# Altium project Project_Left.PrjPcb
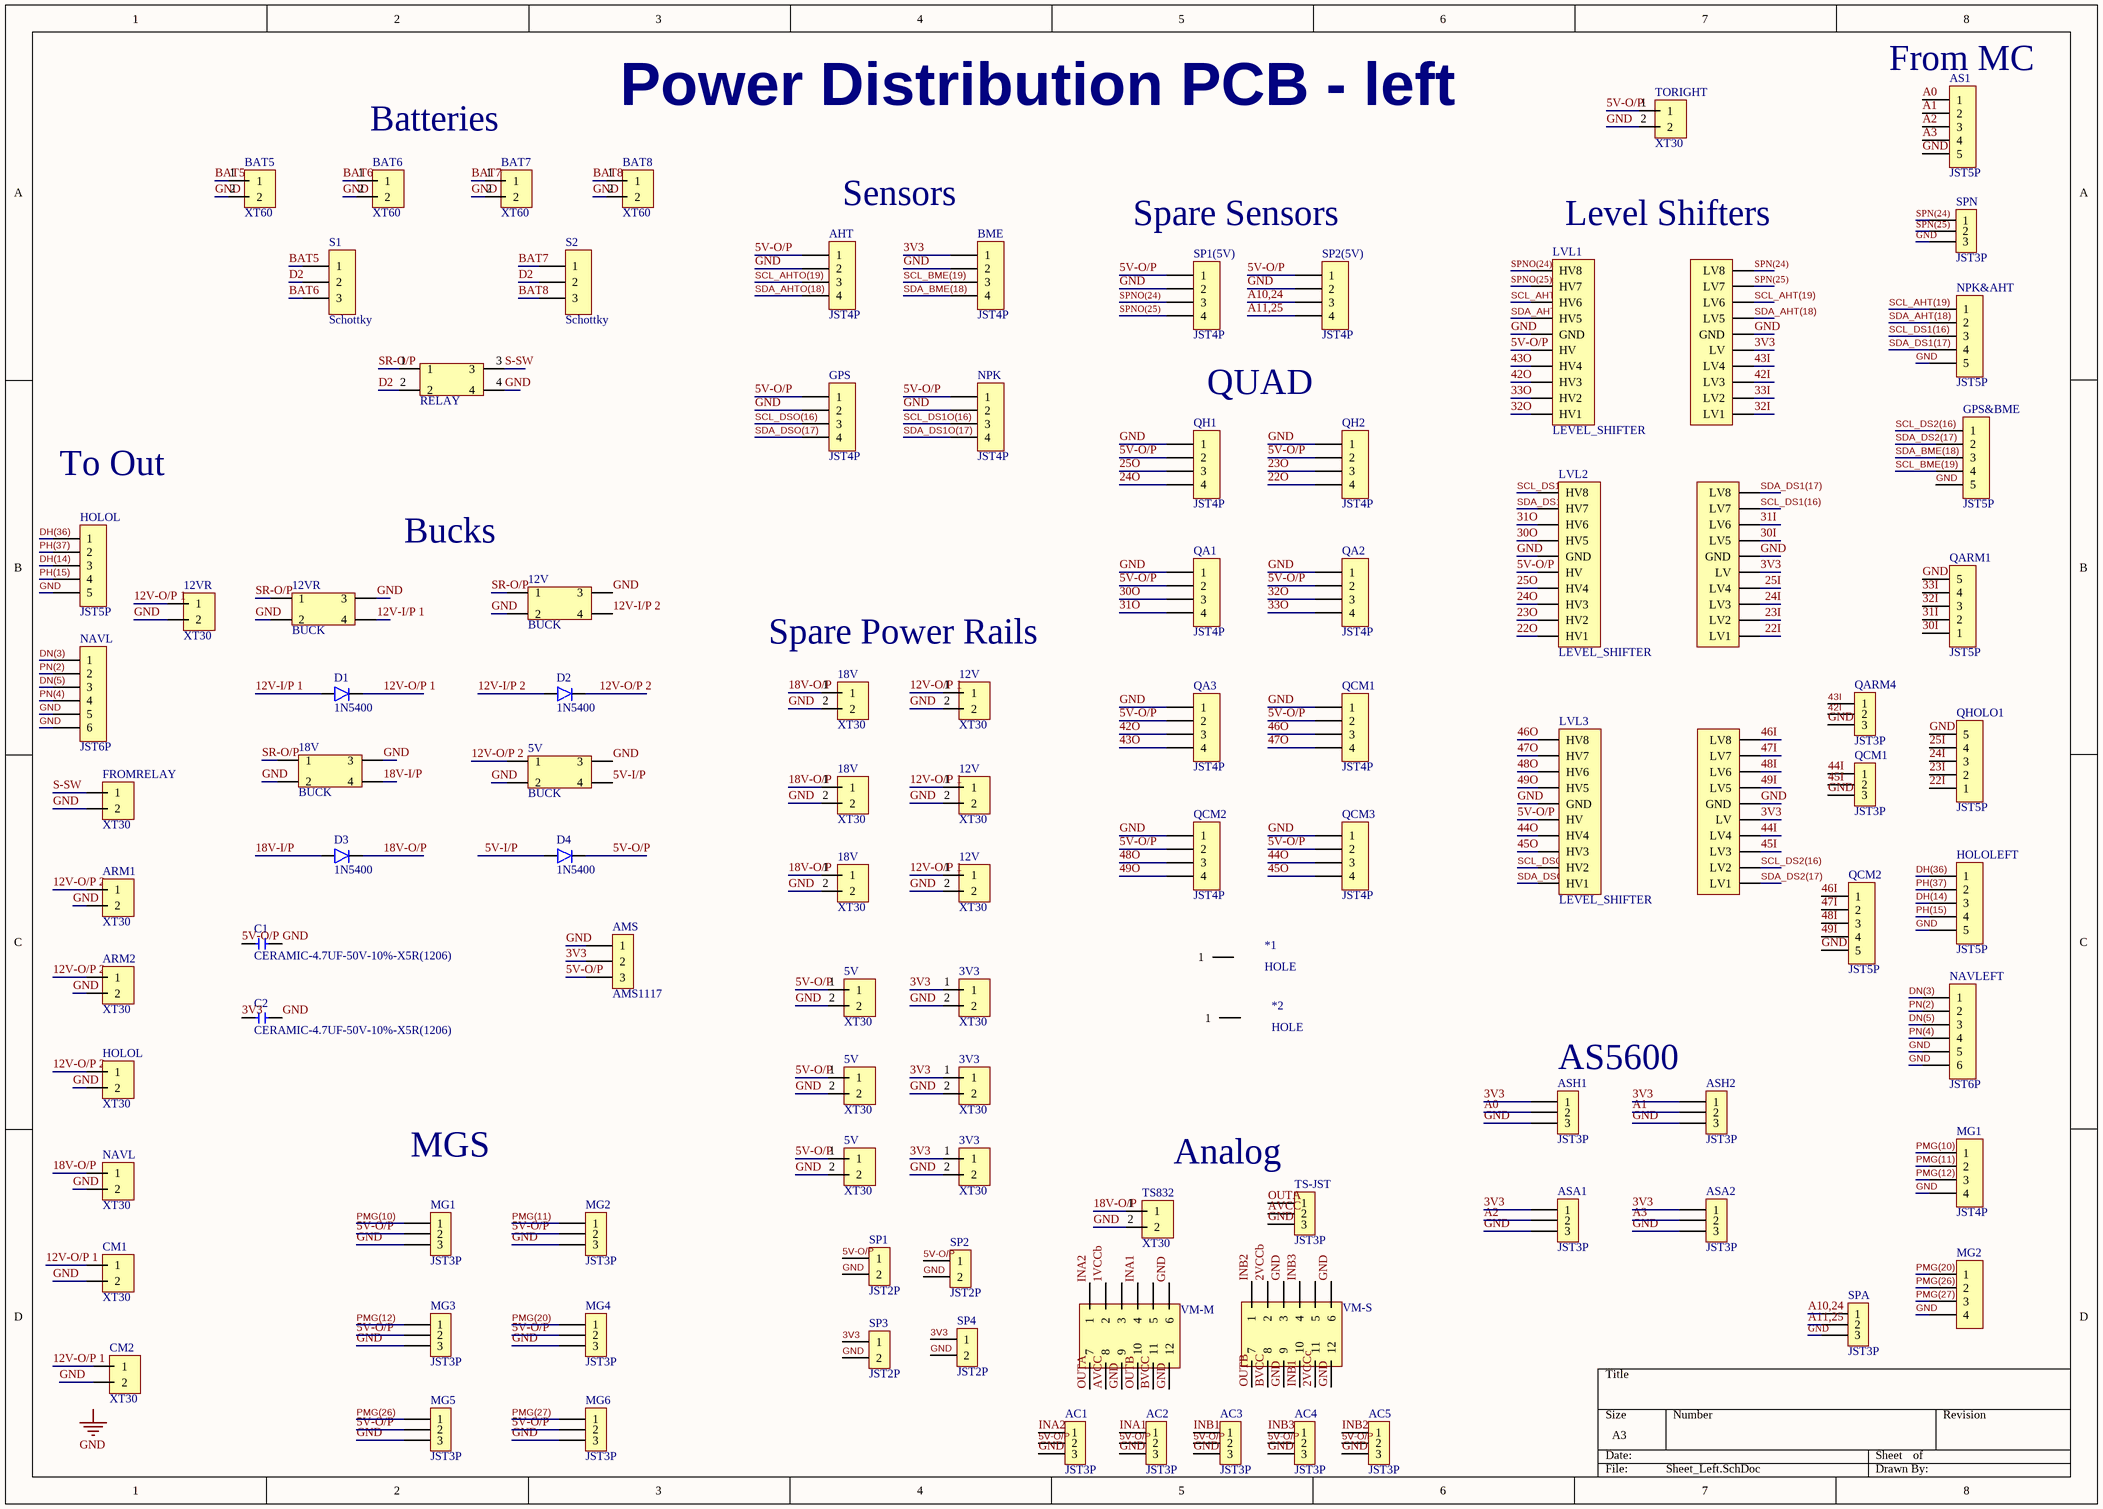
[diagram p0: Sheet_Left.SchDoc]
1 sheet, 97 parts. Net scope: global (net labels, ports and power ports of the same name join across sheets).
Board file: Left_PCB.PcbDoc

## Sheet Sheet_Left.SchDoc
size A3

### Parts
(Parts that share a designator on the sheet are numbered #1, #2 ... from top to bottom, then left to right.)
3V3#1  XT30  [XT30_FEMALE]
3V3#2  XT30  [XT30_FEMALE]
3V3#3  XT30  [XT30_FEMALE]
5V#1  BUCK  [BUCKY]
5V#2  XT30  [XT30_FEMALE]
5V#3  XT30  [XT30_FEMALE]
5V#4  XT30  [XT30_FEMALE]
12V#1  BUCK  [BUCKY]
12V#2  XT30  [XT30_FEMALE]
12V#3  XT30  [XT30_FEMALE]
12V#4  XT30  [XT30_FEMALE]
12VR#1  XT30  [XT30_FEMALE]
12VR#2  BUCK  [BUCKY]
18V#1  XT30  [XT30_FEMALE]
18V#2  BUCK  [BUCKY]
18V#3  XT30  [XT30_FEMALE]
18V#4  XT30  [XT30_FEMALE]
*1  HOLE  [HOLE]
*2  HOLE  [HOLE]
AC1  JST3P  [JST3P]
AC2  JST3P  [JST3P]
AC3  JST3P  [JST3P]
AC4  JST3P  [JST3P]
AC5  JST3P  [JST3P]
AHT  JST4P  [JST4P]
AMS  AMS1117  [AMS1117]
ARM1  XT30  [XT30_FEMALE]
ARM2  XT30  [XT30_FEMALE]
AS1  JST5P  [JST5P]
ASA1  JST3P  [JST3P]
ASA2  JST3P  [JST3P]
ASH1  JST3P  [JST3P]
ASH2  JST3P  [JST3P]
BAT5  XT60  [XT60_FEMALE]
BAT6  XT60  [XT60_FEMALE]
BAT7  XT60  [XT60_FEMALE]
BAT8  XT60  [XT60_FEMALE]
BME  JST4P  [JST4P]
C1  CERAMIC-4.7UF-50V-10%-X5R(1206)  [CAP0805]
C2  CERAMIC-4.7UF-50V-10%-X5R(1206)  [CAP0805]
CM1  XT30  [XT30_FEMALE]
CM2  XT30  [XT30_FEMALE]
D1  1N5400  [DO201-15]
D2  1N5400  [DO201-15]
D3  1N5400  [DO201-15]
D4  1N5400  [DO201-15]
FROMRELAY  XT30  [XT30_FEMALE]
GPS  JST4P  [JST4P]
GPS&BME  JST5P  [JST5P]
HOLOL#1  JST5P  [JST5P]
HOLOL#2  XT30  [XT30_FEMALE]
HOLOLEFT  JST5P  [JST5P]
LVL1  LEVEL_SHIFTER  [LEVEL_SHIFTER]
LVL2  LEVEL_SHIFTER  [LEVEL_SHIFTER]
LVL3  LEVEL_SHIFTER  [LEVEL_SHIFTER]
MG1#1  JST4P  [JST4P]
MG1#2  JST3P  [JST3P]
MG2#1  JST3P  [JST3P]
MG2#2  JST4P  [JST4P]  (value not drawn)
MG3  JST3P  [JST3P]
MG4  JST3P  [JST3P]
MG5  JST3P  [JST3P]
MG6  JST3P  [JST3P]
NAVL#1  JST6P  [JST6P]
NAVL#2  XT30  [XT30_FEMALE]
NAVLEFT  JST6P  [JST6P]
NPK  JST4P  [JST4P]
NPK&AHT  JST5P  [JST5P]
QA1  JST4P  [JST4P]
QA2  JST4P  [JST4P]
QA3  JST4P  [JST4P]
QARM1  JST5P  [JST5P]
QARM4  JST3P  [JST3P]
QCM1#1  JST4P  [JST4P]
QCM1#2  JST3P  [JST3P]
QCM2#1  JST4P  [JST4P]
QCM2#2  JST5P  [JST5P]
QCM3  JST4P  [JST4P]
QH1  JST4P  [JST4P]
QH2  JST4P  [JST4P]
QHOLO1  JST5P  [JST5P]
S1  Schottky  [schottky diode]
S2  Schottky  [schottky diode]
SP1  JST2P  [JST2P]
SP1(5V)  JST4P  [JST4P]
SP2  JST2P  [JST2P]
SP2(5V)  JST4P  [JST4P]
SP3  JST2P  [JST2P]
SP4  JST2P  [JST2P]
SPA  JST3P  [JST3P]
SPN  JST3P  [JST3P]
SR  RELAY  [Relay]
TORIGHT  XT30  [XT30_FEMALE]
TS832  XT30  [XT30_FEMALE]
TS-JST  JST3P  [JST3P]
VM-M  VM1  [6x2Header]  (value not drawn)
VM-S  VM2  [6x2Header]  (value not drawn)

### Nets
GND: 3V3#1.2 3V3#2.2 3V3#3.2 5V#1.2 5V#1.3 5V#2.2 5V#3.2 5V#4.2 12V#1.2 12V#1.3 12V#2.2 12V#3.2 12V#4.2 12VR#1.2 12VR#2.2 12VR#2.3 18V#1.2 18V#2.2 18V#2.3 18V#3.2 18V#4.2 AC1.3 AC2.3 AC3.3 AC4.3 AC5.3 AHT.2 AMS.1 ARM1.2 ARM2.2 AS1.5 ASA1.3 ASA2.3 ASH1.3 ASH2.3 BAT5.2 BAT6.2 BAT7.2 BAT8.2 BME.2 C1.2 C2.2 CM1.2 CM2.2 FROMRELAY.2 GPS.2 GPS&BME.5 HOLOL#1.5 HOLOL#2.2 HOLOLEFT.5 LVL1.GND LVL2.GND LVL3.GND MG1#1.4 MG1#2.3 MG2#1.3 MG2#2.4 MG3.3 MG4.3 MG5.3 MG6.3 NAVL#1.5 NAVL#1.6 NAVL#2.2 NAVLEFT.5 NAVLEFT.6 NPK.2 NPK&AHT.5 QA1.1 QA2.1 QA3.1 QARM1.5 QARM4.3 QCM1#1.1 QCM1#2.3 QCM2#1.1 QCM2#2.5 QCM3.1 QH1.1 QH2.1 QHOLO1.5 SP1.2 SP1(5V).2 SP2.2 SP2(5V).2 SP3.2 SP4.2 SPA.3 SPN.3 SR.4 TORIGHT.2 TS832.2 TS-JST.3 VM-M.6 VM-M.9 VM-M.12 VM-S.3 VM-S.6 VM-S.9 VM-S.12
1VCCb: VM-M.2
2VCCb: VM-S.2
2VCCc: VM-S.11
3V3: 3V3#1.1 3V3#2.1 3V3#3.1 AMS.2 ASA1.1 ASA2.1 ASH1.1 ASH2.1 BME.1 C2.1 LVL1.LV LVL2.LV LVL3.LV SP3.1 SP4.1
5V-I/P: 5V#1.4 D4.A
5V-O/P: 5V#2.1 5V#3.1 5V#4.1 AC1.2 AC2.2 AC3.2 AC4.2 AC5.2 AHT.1 AMS.3 C1.1 D4.C GPS.1 LVL1.HV LVL2.HV LVL3.HV MG1#2.2 MG2#1.2 MG3.2 MG4.2 MG5.2 MG6.2 NPK.1 QA1.2 QA2.2 QA3.2 QCM1#1.2 QCM2#1.2 QCM3.2 QH1.2 QH2.2 SP1.1 SP1(5V).1 SP2.1 SP2(5V).1 TORIGHT.1
12V-I/P 1: 12VR#2.4 D1.A
12V-I/P 2: 12V#1.4 D2.A
12V-O/P 1: 12V#2.1 12V#3.1 12V#4.1 12VR#1.1 CM1.1 CM2.1 D1.C
12V-O/P 2: 5V#1.1 ARM1.1 ARM2.1 D2.C HOLOL#2.1
18V-I/P: 18V#2.4 D3.A
18V-O/P: 18V#1.1 18V#3.1 18V#4.1 D3.C NAVL#2.1 TS832.1
22I: LVL2.LV1 QHOLO1.1
22O: LVL2.HV1 QH2.4
23I: LVL2.LV2 QHOLO1.2
23O: LVL2.HV2 QH2.3
24I: LVL2.LV3 QHOLO1.3
24O: LVL2.HV3 QH1.4
25I: LVL2.LV4 QHOLO1.4
25O: LVL2.HV4 QH1.3
30I: LVL2.LV5 QARM1.1
30O: LVL2.HV5 QA1.3
31I: LVL2.LV6 QARM1.2
31O: LVL2.HV6 QA1.4
32I: LVL1.LV1 QARM1.3
32O: LVL1.HV1 QA2.3
33I: LVL1.LV2 QARM1.4
33O: LVL1.HV2 QA2.4
42I: LVL1.LV3 QARM4.2
42O: LVL1.HV3 QA3.3
43I: LVL1.LV4 QARM4.1
43O: LVL1.HV4 QA3.4
44I: LVL3.LV4 QCM1#2.1
44O: LVL3.HV4 QCM3.3
45I: LVL3.LV3 QCM1#2.2
45O: LVL3.HV3 QCM3.4
46I: LVL3.LV8 QCM2#2.1
46O: LVL3.HV8 QCM1#1.3
47I: LVL3.LV7 QCM2#2.2
47O: LVL3.HV7 QCM1#1.4
48I: LVL3.LV6 QCM2#2.3
48O: LVL3.HV6 QCM2#1.3
49I: LVL3.LV5 QCM2#2.4
49O: LVL3.HV5 QCM2#1.4
A0: AS1.1 ASH1.2
A1: AS1.2 ASH2.2
A2: AS1.3 ASA1.2
A3: AS1.4 ASA2.2
A10,24: SP2(5V).3 SPA.1
A11,25: SP2(5V).4 SPA.2
AVCC: TS-JST.2 VM-M.8
BAT5: BAT5.1 S1.1
BAT6: BAT6.1 S1.3
BAT7: BAT7.1 S2.1
BAT8: BAT8.1 S2.3
BVCC: VM-M.11 VM-S.8
D2: S1.2 S2.2 SR.2
DH(14): HOLOL#1.3 HOLOLEFT.3
DH(36): HOLOL#1.1 HOLOLEFT.1
DN(3): NAVL#1.1 NAVLEFT.1
DN(5): NAVL#1.3 NAVLEFT.3
INA1: AC2.1 VM-M.4
INA2: AC1.1 VM-M.1
INB1: AC3.1 VM-S.10
INB2: AC5.1 VM-S.1
INB3: AC4.1 VM-S.4
OUTA: TS-JST.1 VM-M.7
OUTB: VM-M.10 VM-S.7
PH(15): HOLOL#1.4 HOLOLEFT.4
PH(37): HOLOL#1.2 HOLOLEFT.2
PMG(10): MG1#1.1 MG1#2.1
PMG(11): MG1#1.2 MG2#1.1
PMG(12): MG1#1.3 MG3.1
PMG(20): MG2#2.1 MG4.1
PMG(26): MG2#2.2 MG5.1
PMG(27): MG2#2.3 MG6.1
PN(2): NAVL#1.2 NAVLEFT.2
PN(4): NAVL#1.4 NAVLEFT.4
S-SW: FROMRELAY.1 SR.3
SCL_AHT(19): LVL1.LV6 NPK&AHT.1
SCL_AHTO(19): AHT.3 LVL1.HV6
SCL_BME(19): BME.3 GPS&BME.4
SCL_DS1(16): LVL2.LV7 NPK&AHT.3
SCL_DS1O(16): LVL2.HV8 NPK.3
SCL_DS2(16): GPS&BME.1 LVL3.LV2
SCL_DSO(16): GPS.3 LVL3.HV2
SDA_AHT(18): LVL1.LV5 NPK&AHT.2
SDA_AHTO(18): AHT.4 LVL1.HV5
SDA_BME(18): BME.4 GPS&BME.3
SDA_DS1(17): LVL2.LV8 NPK&AHT.4
SDA_DS1O(17): LVL2.HV7 NPK.4
SDA_DS2(17): GPS&BME.2 LVL3.LV1
SDA_DSO(17): GPS.4 LVL3.HV1
SPN(24): LVL1.LV8 SPN.1
SPN(25): LVL1.LV7 SPN.2
SPNO(24): LVL1.HV8 SP1(5V).3
SPNO(25): LVL1.HV7 SP1(5V).4
SR-O/P: 12V#1.1 12VR#2.1 18V#2.1 SR.1

Not connected (* = marked no-connect by the designer): *1 1; *2 1; VM-M 3 5; VM-S 5

### Notes on the sheet
- (near AS1) From MC
- Batteries
- Power Distribution PCB - left
- Sensors
- Spare Sensors
- (near LVL1) Level Shifters
- QUAD
- To Out
- Bucks
- Spare Power Rails
- (near ASH1) AS5600
- MGS
- Analog
- Labels drawn without touching a wire or pin: GND

### Library data of the parts
C1 C2 = CERAMIC-4.7UF-50V-10%-X5R(1206): 4.7 ÂµF Â±10% 50V Ceramic Capacitor X5R 1206 (3216 Metric); MF: Yageo; MP: CC1206KKX5R9BB475; SnapEDA_Link: https://www.snapeda.com/parts/CC1206KKX5R9BB475/Yageo/view-part/?ref=snap; Package: SMD-2 Yageo; Value: *; Check_prices: https://www.snapeda.com/parts/CC1206KKX5R9BB475/Yageo/view-part/?ref=eda
D1-D4 = 1N5400: Diode Standard 50 V 3A Through Hole DO-201AD; MF: Diodes Inc.; MP: 1N5400-T; SnapEDA_Link: https://www.snapeda.com/parts/1N5400-T/Diodes+Inc./view-part/?ref=snap; Package: DO-201 Diodes Inc.; Value: *; Check_prices: https://www.snapeda.com/parts/1N5400-T/Diodes+Inc./view-part/?ref=eda
SR = RELAY: Power Relay SPDT 30A 24V; Manufacturer: TE Connectivity; Manufacturer Part Number: V23134A4064X551-EV-CBOX; Supplier 1: Digikey; RoHS: No; Stock 1: 33; Pricing 1: 1=21.98, 10=19.576, 25=18.6936, 50=18.0516, 110=17.34791, 330=16.41191, 550=15.99385 (USD); Supplier Part Number 1: 41-V23134A4064X551-EV-CBOX-ND
VM-M VM-S = 6X2Headers